# Altium schematic sheet karmanDB_testpoints.SchDoc
size A
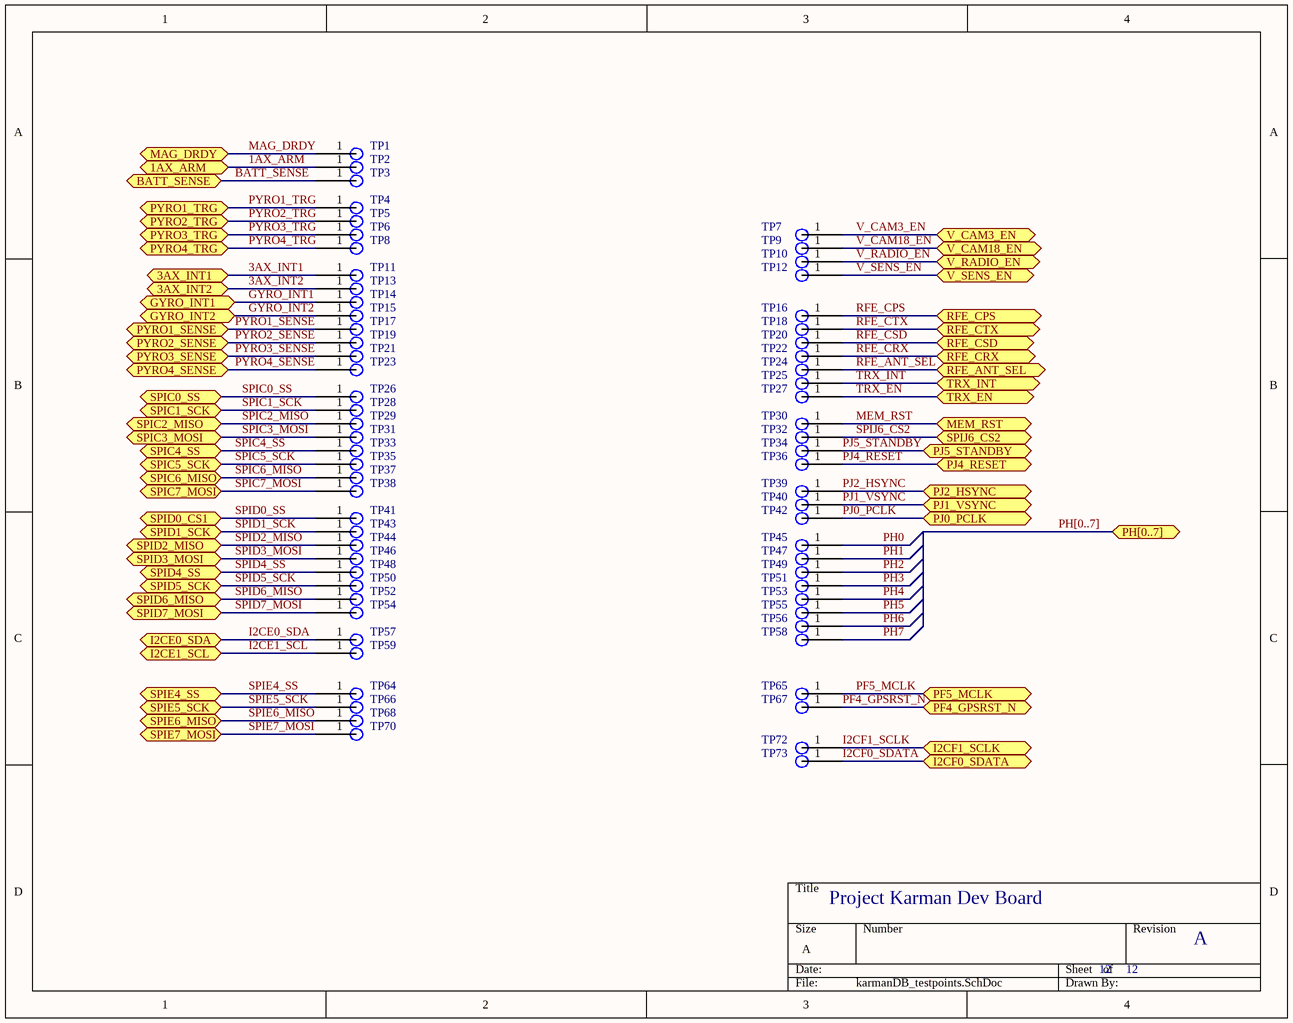
[diagram p0: karmanDB_testpoints.SchDoc]

## Parts
TP1  test_point  [TESTPOINT]  (value not drawn)
TP2  test_point  [TESTPOINT]  (value not drawn)
TP3  test_point  [TESTPOINT]  (value not drawn)
TP4  test_point  [TESTPOINT]  (value not drawn)
TP5  test_point  [TESTPOINT]  (value not drawn)
TP6  test_point  [TESTPOINT]  (value not drawn)
TP7  test_point  [TESTPOINT]  (value not drawn)
TP8  test_point  [TESTPOINT]  (value not drawn)
TP9  test_point  [TESTPOINT]  (value not drawn)
TP10  test_point  [TESTPOINT]  (value not drawn)
TP11  test_point  [TESTPOINT]  (value not drawn)
TP12  test_point  [TESTPOINT]  (value not drawn)
TP13  test_point  [TESTPOINT]  (value not drawn)
TP14  test_point  [TESTPOINT]  (value not drawn)
TP15  test_point  [TESTPOINT]  (value not drawn)
TP16  test_point  [TESTPOINT]  (value not drawn)
TP17  test_point  [TESTPOINT]  (value not drawn)
TP18  test_point  [TESTPOINT]  (value not drawn)
TP19  test_point  [TESTPOINT]  (value not drawn)
TP20  test_point  [TESTPOINT]  (value not drawn)
TP21  test_point  [TESTPOINT]  (value not drawn)
TP22  test_point  [TESTPOINT]  (value not drawn)
TP23  test_point  [TESTPOINT]  (value not drawn)
TP24  test_point  [TESTPOINT]  (value not drawn)
TP25  test_point  [TESTPOINT]  (value not drawn)
TP26  test_point  [TESTPOINT]  (value not drawn)
TP27  test_point  [TESTPOINT]  (value not drawn)
TP28  test_point  [TESTPOINT]  (value not drawn)
TP29  test_point  [TESTPOINT]  (value not drawn)
TP30  test_point  [TESTPOINT]  (value not drawn)
TP31  test_point  [TESTPOINT]  (value not drawn)
TP32  test_point  [TESTPOINT]  (value not drawn)
TP33  test_point  [TESTPOINT]  (value not drawn)
TP34  test_point  [TESTPOINT]  (value not drawn)
TP35  test_point  [TESTPOINT]  (value not drawn)
TP36  test_point  [TESTPOINT]  (value not drawn)
TP37  test_point  [TESTPOINT]  (value not drawn)
TP38  test_point  [TESTPOINT]  (value not drawn)
TP39  test_point  [TESTPOINT]  (value not drawn)
TP40  test_point  [TESTPOINT]  (value not drawn)
TP41  test_point  [TESTPOINT]  (value not drawn)
TP42  test_point  [TESTPOINT]  (value not drawn)
TP43  test_point  [TESTPOINT]  (value not drawn)
TP44  test_point  [TESTPOINT]  (value not drawn)
TP45  test_point  [TESTPOINT]  (value not drawn)
TP46  test_point  [TESTPOINT]  (value not drawn)
TP47  test_point  [TESTPOINT]  (value not drawn)
TP48  test_point  [TESTPOINT]  (value not drawn)
TP49  test_point  [TESTPOINT]  (value not drawn)
TP50  test_point  [TESTPOINT]  (value not drawn)
TP51  test_point  [TESTPOINT]  (value not drawn)
TP52  test_point  [TESTPOINT]  (value not drawn)
TP53  test_point  [TESTPOINT]  (value not drawn)
TP54  test_point  [TESTPOINT]  (value not drawn)
TP55  test_point  [TESTPOINT]  (value not drawn)
TP56  test_point  [TESTPOINT]  (value not drawn)
TP57  test_point  [TESTPOINT]  (value not drawn)
TP58  test_point  [TESTPOINT]  (value not drawn)
TP59  test_point  [TESTPOINT]  (value not drawn)
TP64  test_point  [TESTPOINT]  (value not drawn)
TP65  test_point  [TESTPOINT]  (value not drawn)
TP66  test_point  [TESTPOINT]  (value not drawn)
TP67  test_point  [TESTPOINT]  (value not drawn)
TP68  test_point  [TESTPOINT]  (value not drawn)
TP70  test_point  [TESTPOINT]  (value not drawn)
TP72  test_point  [TESTPOINT]  (value not drawn)
TP73  test_point  [TESTPOINT]  (value not drawn)

## Ports
1AX_ARM (bidir), 3AX_INT1 (bidir), 3AX_INT2 (bidir), BATT_SENSE (bidir), GYRO_INT1 (bidir), GYRO_INT2 (bidir), I2CE0_SDA (bidir), I2CE1_SCL (bidir), I2CF0_SDATA (bidir), I2CF1_SCLK (bidir), MAG_DRDY (bidir), MEM_RST (bidir), PF4_GPSRST_N (bidir), PF5_MCLK (bidir), PH[0..7] (bidir), PJ0_PCLK (bidir), PJ1_VSYNC (bidir), PJ2_HSYNC (bidir), PJ4_RESET (bidir), PJ5_STANDBY (bidir), PYRO1_SENSE (bidir), PYRO1_TRG (bidir), PYRO2_SENSE (bidir), PYRO2_TRG (bidir), PYRO3_SENSE (bidir), PYRO3_TRG (bidir), PYRO4_SENSE (bidir), PYRO4_TRG (bidir), RFE_ANT_SEL (bidir), RFE_CPS (bidir), RFE_CRX (bidir), RFE_CSD (bidir), RFE_CTX (bidir), SPIC0_SS (bidir), SPIC1_SCK (bidir), SPIC2_MISO (bidir), SPIC3_MOSI (bidir), SPIC4_SS (bidir), SPIC5_SCK (bidir), SPIC6_MISO (bidir), SPIC7_MOSI (bidir), SPID0_CS1 (bidir), SPID1_SCK (bidir), SPID2_MISO (bidir), SPID3_MOSI (bidir), SPID4_SS (bidir), SPID5_SCK (bidir), SPID6_MISO (bidir), SPID7_MOSI (bidir), SPIE4_SS (bidir), SPIE5_SCK (bidir), SPIE6_MISO (bidir), SPIE7_MOSI (bidir), SPIJ6_CS2 (bidir), TRX_EN (bidir), TRX_INT (bidir), V_CAM3_EN (bidir), V_CAM18_EN (bidir), V_RADIO_EN (bidir), V_SENS_EN (bidir)

## Nets
1AX_ARM: TP2.1 ; port 1AX_ARM
3AX_INT1: TP11.1 ; port 3AX_INT1
3AX_INT2: TP13.1 ; port 3AX_INT2
BATT_SENSE: TP3.1 ; port BATT_SENSE
GYRO_INT1: TP14.1 ; port GYRO_INT1
GYRO_INT2: TP15.1 ; port GYRO_INT2
I2CE0_SDA: TP57.1 ; port I2CE0_SDA
I2CE1_SCL: TP59.1 ; port I2CE1_SCL
I2CF0_SDATA: TP73.1 ; port I2CF0_SDATA
I2CF1_SCLK: TP72.1 ; port I2CF1_SCLK
MAG_DRDY: TP1.1 ; port MAG_DRDY
MEM_RST: TP30.1 ; port MEM_RST
PF4_GPSRST_N: TP67.1 ; port PF4_GPSRST_N
PF5_MCLK: TP65.1 ; port PF5_MCLK
PH0: TP45.1
PH1: TP47.1
PH2: TP49.1
PH3: TP51.1
PH4: TP53.1
PH5: TP55.1
PH6: TP56.1
PH7: TP58.1
PJ0_PCLK: TP42.1 ; port PJ0_PCLK
PJ1_VSYNC: TP40.1 ; port PJ1_VSYNC
PJ2_HSYNC: TP39.1 ; port PJ2_HSYNC
PJ4_RESET: TP36.1 ; port PJ4_RESET
PJ5_STANDBY: TP34.1 ; port PJ5_STANDBY
PYRO1_SENSE: TP17.1 ; port PYRO1_SENSE
PYRO1_TRG: TP4.1 ; port PYRO1_TRG
PYRO2_SENSE: TP19.1 ; port PYRO2_SENSE
PYRO2_TRG: TP5.1 ; port PYRO2_TRG
PYRO3_SENSE: TP21.1 ; port PYRO3_SENSE
PYRO3_TRG: TP6.1 ; port PYRO3_TRG
PYRO4_SENSE: TP23.1 ; port PYRO4_SENSE
PYRO4_TRG: TP8.1 ; port PYRO4_TRG
RFE_ANT_SEL: TP24.1 ; port RFE_ANT_SEL
RFE_CPS: TP16.1 ; port RFE_CPS
RFE_CRX: TP22.1 ; port RFE_CRX
RFE_CSD: TP20.1 ; port RFE_CSD
RFE_CTX: TP18.1 ; port RFE_CTX
SPIC0_SS: TP26.1 ; port SPIC0_SS
SPIC1_SCK: TP28.1 ; port SPIC1_SCK
SPIC2_MISO: TP29.1 ; port SPIC2_MISO
SPIC3_MOSI: TP31.1 ; port SPIC3_MOSI
SPIC4_SS: TP33.1 ; port SPIC4_SS
SPIC5_SCK: TP35.1 ; port SPIC5_SCK
SPIC6_MISO: TP37.1 ; port SPIC6_MISO
SPIC7_MOSI: TP38.1 ; port SPIC7_MOSI
SPID0_SS: TP41.1 ; port SPID0_CS1
SPID1_SCK: TP43.1 ; port SPID1_SCK
SPID2_MISO: TP44.1 ; port SPID2_MISO
SPID3_MOSI: TP46.1 ; port SPID3_MOSI
SPID4_SS: TP48.1 ; port SPID4_SS
SPID5_SCK: TP50.1 ; port SPID5_SCK
SPID6_MISO: TP52.1 ; port SPID6_MISO
SPID7_MOSI: TP54.1 ; port SPID7_MOSI
SPIE4_SS: TP64.1 ; port SPIE4_SS
SPIE5_SCK: TP66.1 ; port SPIE5_SCK
SPIE6_MISO: TP68.1 ; port SPIE6_MISO
SPIE7_MOSI: TP70.1 ; port SPIE7_MOSI
SPIJ6_CS2: TP32.1 ; port SPIJ6_CS2
TRX_EN: TP27.1 ; port TRX_EN
TRX_INT: TP25.1 ; port TRX_INT
V_CAM3_EN: TP7.1 ; port V_CAM3_EN
V_CAM18_EN: TP9.1 ; port V_CAM18_EN
V_RADIO_EN: TP10.1 ; port V_RADIO_EN
V_SENS_EN: TP12.1 ; port V_SENS_EN

## Buses and harness runs
bus PH[0..7] = port PH[0..7]

## Notes on the sheet
- Project Karman Dev Board
- 12
- A